# Altium project VESC6.PrjPcb
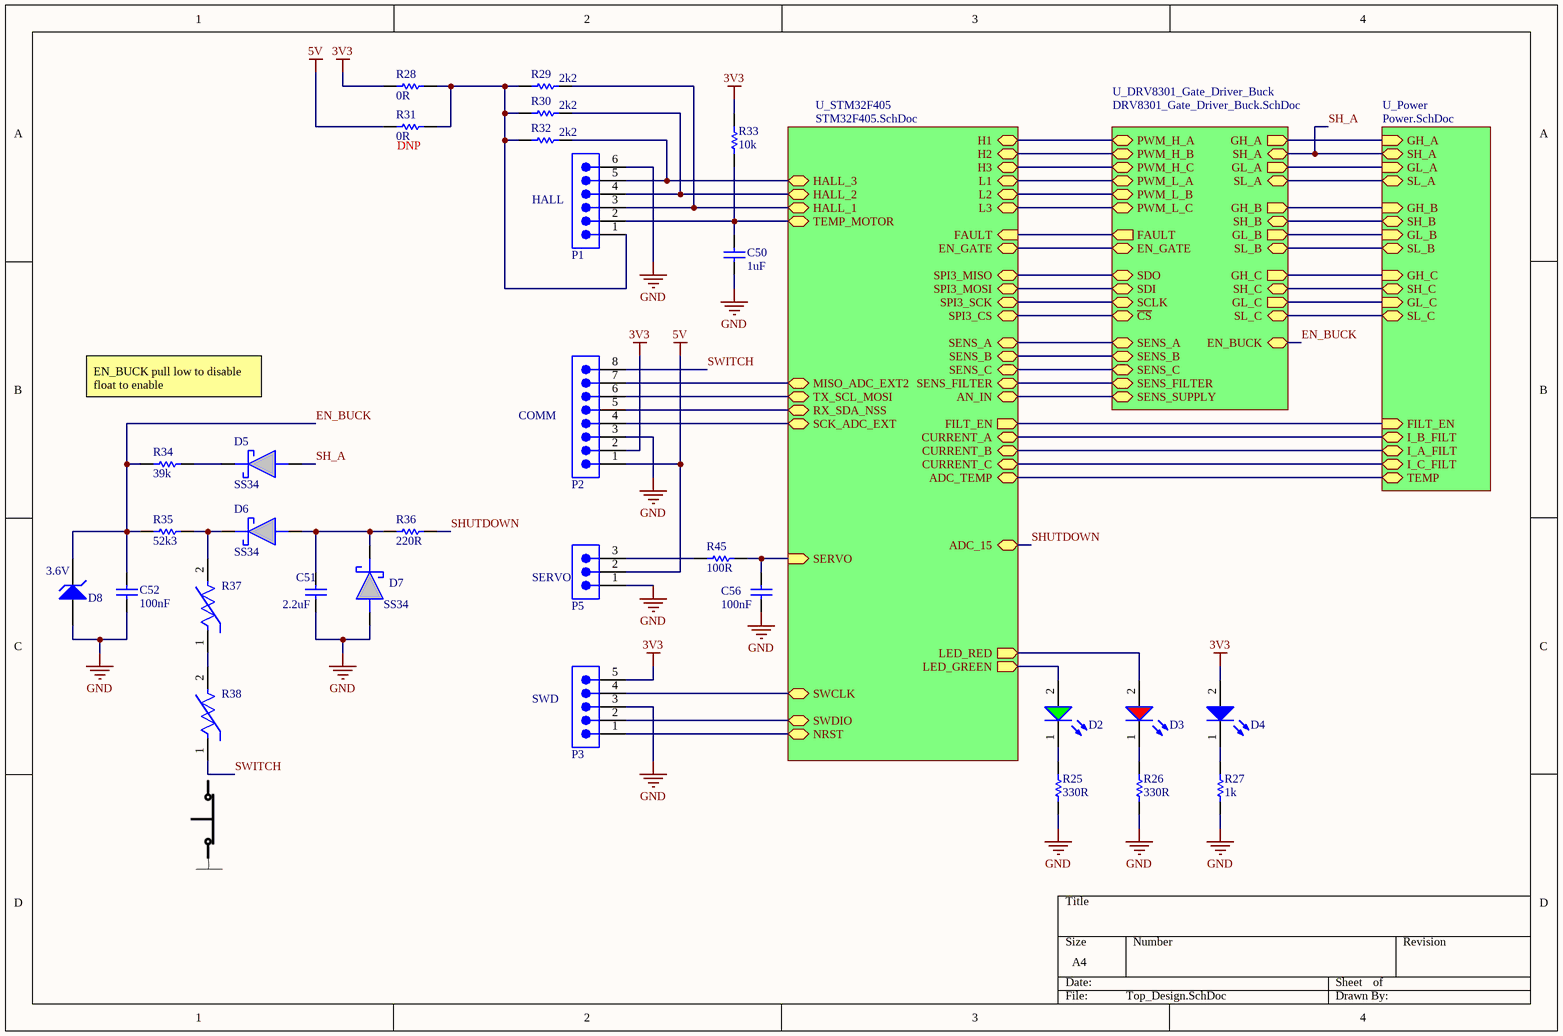
[diagram p0: Top_Design.SchDoc]
4 sheets, 139 parts. Net scope: hierarchical (ports join the sheet entries above them; power ports are global).
Board file: Main_PCB.PcbDoc
Sheets:
  Top_Design.SchDoc
    U_DRV8301_Gate_Driver_Buck = DRV8301_Gate_Driver_Buck.SchDoc
    U_Power = Power.SchDoc
    U_STM32F405 = STM32F405.SchDoc

## Sheet Top_Design.SchDoc
size A4; SheetNumber: 1; SheetTotal: 4

### Parts
C50  value 1uF  [Wurth 0603 capacitor]  (hidden comment: Generic Capacitor 1uF 0603)
C51  value 2.2uF  [Wurth 0603 capacitor]  (hidden comment: Generic Capacitor 2.2uF 0603)
C52  value 100nF  [Wurth 0603 capacitor]  (hidden comment: Generic Capacitor 100nF 0603)
C56  value 100nF  [Wurth 0603 capacitor]  (hidden comment: Generic Capacitor 100nF 0603)
D2  Green, 3.2V, 140°  [Wurth 0603 LED]  (value not drawn)
D3  Red, 2V, 140°  [Wurth 0603 LED]  (value not drawn)
D4  Blue, 3.2V, 140°  [Wurth 0603 LED]  (value not drawn)
D5  SS34  [MDD DO-214AC diode]
D6  SS34  [MDD DO-214AC diode]
D7  SS34  [MDD DO-214AC diode]
D8  ROHM EDZVT2R3.6B  [ROHM SOD-523 zener]  (value not drawn)
P1  61300611121  [6x1 2.54mm M]  (value not drawn)
P2  61300811121  [8x1 2.54mm M]  (value not drawn)
P3  61300511121  [5x1 2.54mm M]  (value not drawn)
P5  61300311121  [3x1 2.54mm M]  (value not drawn)
R25  value 330R  [Wurth 0603 Resistor]  (hidden comment: Generic Resistor 330R 0603)
R26  value 330R  [Wurth 0603 Resistor]  (hidden comment: Generic Resistor 330R 0603)
R27  value 1k  [Wurth 0603 Resistor]  (hidden comment: Generic Resistor 1k 0603)
R28  value 0R  [Wurth 0603 Resistor]  (hidden comment: Generic Resistor 0R 0603)
R29  value 2k2  [Wurth 0603 Resistor]  (hidden comment: Generic Resistor 2k2 0603)
R30  value 2k2  [Wurth 0603 Resistor]  (hidden comment: Generic Resistor 2k2 0603)
R31  value 0R  [Wurth 0603 Resistor]  (hidden comment: Generic Resistor 0R 0603)
R32  value 2k2  [Wurth 0603 Resistor]  (hidden comment: Generic Resistor 2k2 0603)
R33  value 10k  [Wurth 0603 Resistor]  (hidden comment: Generic Resistor 10k 0603)
R34  value 39k  [Wurth 0603 Resistor]  (hidden comment: Generic Resistor 39k 0603)
R35  value 52k3  [Wurth 0603 Resistor]  (hidden comment: Generic Resistor 52k3 0603)
R36  value 220R  [Wurth 0603 Resistor]  (hidden comment: Generic Resistor 220R 0603)
R37  PRF15BC102RB6RC  [FP-PRF15-0_05-IPC_B]  (value not drawn)
R38  PRF15BC102RB6RC  [FP-PRF15-0_05-IPC_B]  (value not drawn)
R45  value 100R  [Wurth 0603 Resistor]  (hidden comment: Generic Resistor 100R 0603)

### Sub-sheets
U_DRV8301_Gate_Driver_Buck = DRV8301_Gate_Driver_Buck.SchDoc: GH_A (out), GH_B (out), GH_C (out), GL_A (out), GL_B (out), GL_C (out), SCLK (bidir), SDI (bidir), SDO (bidir), ~{CS} (bidir), SH_A (bidir), SL_A (bidir), SL_B (bidir), SL_C (bidir), PWM_L_A (bidir), PWM_L_B (bidir), PWM_L_C (bidir), PWM_H_C (bidir), PWM_H_B (bidir), PWM_H_A (bidir), SH_C (bidir), SH_B (bidir), EN_BUCK (bidir), SENS_A (bidir), SENS_B (bidir), SENS_C (bidir), EN_GATE (bidir), SENS_FILTER (bidir), SENS_SUPPLY (bidir), FAULT (out)
U_Power = Power.SchDoc: GH_A (in), GL_A (in), GH_B (in), GL_B (in), GH_C (in), GL_C (in), SH_A (bidir), SL_A (bidir), SH_B (bidir), SL_B (bidir), SH_C (bidir), SL_C (bidir), I_A_FILT (bidir), I_B_FILT (bidir), I_C_FILT (bidir), FILT_EN (in), TEMP (bidir)
U_STM32F405 = STM32F405.SchDoc: EN_GATE (bidir), RX_SDA_NSS (bidir), L1 (bidir), L2 (bidir), L3 (bidir), SENS_A (bidir), SENS_B (bidir), SENS_C (bidir), ADC_TEMP (bidir), SCK_ADC_EXT (bidir), H1 (bidir), H2 (bidir), H3 (bidir), SWDIO (bidir), SWCLK (bidir), CURRENT_A (bidir), CURRENT_B (bidir), CURRENT_C (bidir), AN_IN (bidir), TEMP_MOTOR (bidir), ADC_15 (bidir), HALL_1 (bidir), HALL_2 (bidir), HALL_3 (bidir), SPI3_CS (bidir), SPI3_SCK (bidir), SENS_FILTER (bidir), SPI3_MOSI (bidir), SPI3_MISO (bidir), LED_GREEN (out), LED_RED (out), MISO_ADC_EXT2 (bidir), TX_SCL_MOSI (bidir), FILT_EN (out), NRST (bidir), FAULT (in), SERVO (in)

### Nets
3V3: D4.2(A) P2.2 P3.5 R28.2 R33.2
5V: P2.1 P5.2 R31.2
GND: C50.1 C51.1 C52.1 C56.1 D7.2(A) D8.2(A) P1.6 P2.3 P3.3 P5.1 R25.2 R26.2 R27.2 ; sheet U_DRV8301_Gate_Driver_Buck/SL_A, sheet U_DRV8301_Gate_Driver_Buck/SL_B, sheet U_DRV8301_Gate_Driver_Buck/SL_C, sheet U_Power/SL_A, sheet U_Power/SL_B, sheet U_Power/SL_C
EN_BUCK: C52.2 D8.1(K) R34.1 R35.1 ; sheet U_DRV8301_Gate_Driver_Buck/EN_BUCK
FILT_EN: sheet U_Power/FILT_EN, sheet U_STM32F405/FILT_EN
SENS_FILTER: sheet U_DRV8301_Gate_Driver_Buck/SENS_FILTER, sheet U_STM32F405/SENS_FILTER
SH_A: D5.2(A) ; sheet U_DRV8301_Gate_Driver_Buck/SH_A, sheet U_Power/SH_A
SH_B: sheet U_DRV8301_Gate_Driver_Buck/SH_B, sheet U_Power/SH_B
SH_C: sheet U_DRV8301_Gate_Driver_Buck/SH_C, sheet U_Power/SH_C
SHUTDOWN: R36.2 ; sheet U_STM32F405/ADC_15
SWITCH: P2.8 R38.1
NetC10_2: sheet U_Power/I_A_FILT, sheet U_STM32F405/CURRENT_B
NetC13_2: sheet U_Power/I_B_FILT, sheet U_STM32F405/CURRENT_A
NetC15_2: sheet U_Power/I_C_FILT, sheet U_STM32F405/CURRENT_C
NetC33_1: sheet U_DRV8301_Gate_Driver_Buck/SENS_A, sheet U_STM32F405/SENS_A
NetC37_1: sheet U_DRV8301_Gate_Driver_Buck/SENS_B, sheet U_STM32F405/SENS_B
NetC40_1: sheet U_DRV8301_Gate_Driver_Buck/SENS_C, sheet U_STM32F405/SENS_C
NetC49_2: P3.1 ; sheet U_STM32F405/NRST
NetC50_2: C50.2 P1.2 R33.1 ; sheet U_STM32F405/TEMP_MOTOR
NetC51_2: C51.2 D6.2(A) D7.1(K) R36.1
NetC55_2: sheet U_Power/TEMP, sheet U_STM32F405/ADC_TEMP
NetC56_2: C56.2 R45.2 ; sheet U_STM32F405/SERVO
NetD2_1: D2.1(K) R25.1
NetD2_2: D2.2(A) ; sheet U_STM32F405/LED_GREEN
NetD3_1: D3.1(K) R26.1
NetD3_2: D3.2(A) ; sheet U_STM32F405/LED_RED
NetD4_1: D4.1(K) R27.1
NetD5_1: D5.1(K) R34.2
NetD6_1: D6.1(K) R35.2 R37.2
NetIC1_6: sheet U_DRV8301_Gate_Driver_Buck/FAULT, sheet U_STM32F405/FAULT
NetIC1_8: sheet U_DRV8301_Gate_Driver_Buck/~{CS}, sheet U_STM32F405/SPI3_CS
NetIC1_9: sheet U_DRV8301_Gate_Driver_Buck/SDI, sheet U_STM32F405/SPI3_MOSI
NetIC1_10: sheet U_DRV8301_Gate_Driver_Buck/SDO, sheet U_STM32F405/SPI3_MISO
NetIC1_11: sheet U_DRV8301_Gate_Driver_Buck/SCLK, sheet U_STM32F405/SPI3_SCK
NetIC1_16: sheet U_DRV8301_Gate_Driver_Buck/EN_GATE, sheet U_STM32F405/EN_GATE
NetIC1_17: sheet U_DRV8301_Gate_Driver_Buck/PWM_H_A, sheet U_STM32F405/H1
NetIC1_18: sheet U_DRV8301_Gate_Driver_Buck/PWM_L_A, sheet U_STM32F405/L1
NetIC1_19: sheet U_DRV8301_Gate_Driver_Buck/PWM_H_B, sheet U_STM32F405/H2
NetIC1_20: sheet U_DRV8301_Gate_Driver_Buck/PWM_L_B, sheet U_STM32F405/L2
NetIC1_21: sheet U_DRV8301_Gate_Driver_Buck/PWM_H_C, sheet U_STM32F405/H3
NetIC1_22: sheet U_DRV8301_Gate_Driver_Buck/PWM_L_C, sheet U_STM32F405/L3
NetIC1_35: sheet U_DRV8301_Gate_Driver_Buck/GL_C, sheet U_Power/GL_C
NetIC1_37: sheet U_DRV8301_Gate_Driver_Buck/GH_C, sheet U_Power/GH_C
NetIC1_40: sheet U_DRV8301_Gate_Driver_Buck/GL_B, sheet U_Power/GL_B
NetIC1_42: sheet U_DRV8301_Gate_Driver_Buck/GH_B, sheet U_Power/GH_B
NetIC1_45: sheet U_DRV8301_Gate_Driver_Buck/GL_A, sheet U_Power/GL_A
NetIC1_47: sheet U_DRV8301_Gate_Driver_Buck/GH_A, sheet U_Power/GH_A
NetP1_1: P1.1 R28.1 R29.1 R30.1 R31.1 R32.1
NetP1_3: P1.3 R29.2 ; sheet U_STM32F405/HALL_1
NetP1_4: P1.4 R30.2 ; sheet U_STM32F405/HALL_2
NetP1_5: P1.5 R32.2 ; sheet U_STM32F405/HALL_3
NetP2_4: P2.4 ; sheet U_STM32F405/SCK_ADC_EXT
NetP2_5: P2.5 ; sheet U_STM32F405/RX_SDA_NSS
NetP2_6: P2.6 ; sheet U_STM32F405/TX_SCL_MOSI
NetP2_7: P2.7 ; sheet U_STM32F405/MISO_ADC_EXT2
NetP3_2: P3.2 ; sheet U_STM32F405/SWDIO
NetP3_4: P3.4 ; sheet U_STM32F405/SWCLK
NetP5_3: P5.3 R45.1
NetQ7_2: sheet U_DRV8301_Gate_Driver_Buck/SENS_SUPPLY, sheet U_STM32F405/AN_IN
NetR37_1: R37.1 R38.2

### Notes on the sheet
- (near R31) DNP
- HALL
- EN_BUCK pull low to disable
  float to enable
- COMM
- (near D8) 3.6V
- (near P5) SERVO
- (near P3) SWD

### Library data of the parts
D2 = LED GREEN 0603: WL-SMCD Mono-color Chip LED Diffused, SMT, size 0603, Green, 3.2V, 140°; Manufacturer Part Number: 150060GS55040; Manufacturer: Wurth Elektronik; Case/Size Code: 0603; Chip Technology: InGaN; Dominant Wavelength: 525nm; Luminous Intensity: 430mcd; Peak Wavelength: 520nm; Category: Signal LEDs; Match Code: WL-SMCD; ComponentLink1Description: Website Link; ComponentLink1URL: https://www.we-online.com/redexpert/article/150060GS55040?ad; ComponentLink2Description: Datasheet Link; ComponentLink2URL: https://www.we-online.com/redexpert/spec/150060GS55040?ad; Mount: Surface Mount; Operating Temperature Max: 85°C; Operating Temperature Min: -40°C; Packaging: Tape and Reel; Length: 1.6mm; Width: 0.8mm; Height: 0.4mm; Emitting Color: Green; Forward Voltage: 3.2V; Viewing Angle: 140°
D3 = LED RED 0603: WL-SMCD Mono-color Chip LED Diffused, SMT, size 0603, Red, 2V, 140°; Manufacturer Part Number: 150060RS55040; Manufacturer: Wurth Elektronik; Case/Size Code: 0603; Chip Technology: AlInGaP; Dominant Wavelength: 624nm; Luminous Intensity: 90mcd; Peak Wavelength: 632nm; Category: Signal LEDs; Match Code: WL-SMCD; ComponentLink1Description: Website Link; ComponentLink1URL: https://www.we-online.com/redexpert/article/150060RS55040?ad; ComponentLink2Description: Datasheet Link; ComponentLink2URL: https://www.we-online.com/redexpert/spec/150060RS55040?ad; Mount: Surface Mount; Operating Temperature Max: 85°C; Operating Temperature Min: -40°C; Packaging: Tape and Reel; Length: 1.6mm; Width: 0.8mm; Height: 0.4mm; Emitting Color: Red; Forward Voltage: 2V; Viewing Angle: 140°
D4 = LED BLUE 0603: WL-SMCD Mono-color Chip LED Diffused, SMT, size 0603, Blue, 3.2V, 140°; Manufacturer Part Number: 150060BS55040; Manufacturer: Wurth Elektronik; Case/Size Code: 0603; Chip Technology: InGaN; Dominant Wavelength: 470nm; Luminous Intensity: 80mcd; Peak Wavelength: 465nm; Category: Signal LEDs; Match Code: WL-SMCD; ComponentLink1Description: Website Link; ComponentLink1URL: https://www.we-online.com/redexpert/article/150060BS55040?ad; ComponentLink2Description: Datasheet Link; ComponentLink2URL: https://www.we-online.com/redexpert/spec/150060BS55040?ad; Mount: Surface Mount; Operating Temperature Max: 85°C; Operating Temperature Min: -40°C; Packaging: Tape and Reel; Length: 1.6mm; Width: 0.8mm; Height: 0.4mm; Emitting Color: Blue; Forward Voltage: 3.2V; Viewing Angle: 140°
D5-D7 = MDD SS34: SS34 Schottky Barrier Diodes (SBD) SMA(DO-214AC) RoHS; Manufacturer_Name: MDD; Geometry.Height: 2.44mm; Manufacturer_Part_Number: SS34; Mouser Part Number: *; Mouser Price/Stock: *; Arrow Part Number: *; Arrow Price/Stock: *; Datasheet Link: https://datasheet.lcsc.com/szlcsc/MDD-Jiangsu-Yutai-Elec-SS34_C13762.pdf
D8 = 3.6V 150mW zener: Independent 3.6V~3.845V 150mW 3.6V SOD-523 Zener Diodes ROHS
P1 = 6P: WR-PHD Pin Header, THT, Vertical, pitch 2.54mm, 1 Row, 6P; Manufacturer: Wurth Elektronik; Contact Resistance: 20mOhm; Rated Current: 3A; Working Voltage: 250V; Withstanding Voltage: 500V; Manufacturer Part Number: 61300611121; Category: Board-to-Board Connectors; Match Code: WR-PHD; ComponentLink1Description: Website Link; ComponentLink1URL: https://www.we-online.com/redexpert/article/61300611121?ad; ComponentLink2Description: Datasheet Link; ComponentLink2URL: https://www.we-online.com/redexpert/spec/61300611121?ad; Mount: Through Hole; Operating Temperature Max: 105°C; Operating Temperature Min: -40°C; Packaging: Bag; Gender: Pin Header; Number of Pins: 6; Number of Rows: 1; Orientation: Vertical; Pitch: 2.54mm
P2 = 8P: WR-PHD Pin Header, THT, Vertical, pitch 2.54mm, 1 Row, 8P; Manufacturer: Wurth Elektronik; Contact Resistance: 20mOhm; Rated Current: 3A; Working Voltage: 250V; Withstanding Voltage: 500V; Manufacturer Part Number: 61300811121; Category: Board-to-Board Connectors; Match Code: WR-PHD; ComponentLink1Description: Website Link; ComponentLink1URL: https://www.we-online.com/redexpert/article/61300811121?ad; ComponentLink2Description: Datasheet Link; ComponentLink2URL: https://www.we-online.com/redexpert/spec/61300811121?ad; Mount: Through Hole; Operating Temperature Max: 105°C; Operating Temperature Min: -40°C; Packaging: Bag; Gender: Pin Header; Number of Pins: 8; Number of Rows: 1; Orientation: Vertical; Pitch: 2.54mm
P3 = 5P: WR-PHD Pin Header, THT, Vertical, pitch 2.54mm, 1 Row, 5P; Manufacturer: Wurth Elektronik; Contact Resistance: 20mOhm; Rated Current: 3A; Working Voltage: 250V; Withstanding Voltage: 500V; Manufacturer Part Number: 61300511121; Category: Board-to-Board Connectors; Match Code: WR-PHD; ComponentLink1Description: Website Link; ComponentLink1URL: https://www.we-online.com/redexpert/article/61300511121?ad; ComponentLink2Description: Datasheet Link; ComponentLink2URL: https://www.we-online.com/redexpert/spec/61300511121?ad; Mount: Through Hole; Operating Temperature Max: 105°C; Operating Temperature Min: -40°C; Packaging: Bag; Gender: Pin Header; Number of Pins: 5; Number of Rows: 1; Orientation: Vertical; Pitch: 2.54mm
P5 = 3P: WR-PHD Pin Header, THT, Vertical, pitch 2.54mm, 1 Row, 3P; Manufacturer: Wurth Elektronik; Contact Resistance: 20mOhm; Rated Current: 3A; Working Voltage: 250V; Withstanding Voltage: 500V; Manufacturer Part Number: 61300311121; Category: Board-to-Board Connectors; Match Code: WR-PHD; ComponentLink1Description: Website Link; ComponentLink1URL: https://www.we-online.com/redexpert/article/61300311121?ad; ComponentLink2Description: Datasheet Link; ComponentLink2URL: https://www.we-online.com/redexpert/spec/61300311121?ad; Mount: Through Hole; Operating Temperature Max: 105°C; Operating Temperature Min: -40°C; Packaging: Bag; Gender: Pin Header; Number of Pins: 3; Number of Rows: 1; Orientation: Vertical; Pitch: 2.54mm
R37 R38 = CMP-06022-000468-1: THERMISTOR PTC 1K OHM 50% 0402; Voltage: 32V; Resistance: 1kR; Case Code (Metric): 1005; Packaging: Tape and Reel; Depth: 0.5mm; Case Code (Imperial): 0402; Length: 1mm; Case/Package: 0402; Number of Pins: 2; Tolerance: 50%; Height: 0.5mm; Min Operating Temperature: -40°C; Mount: Surface Mount; Max Operating Temperature: 130°C; Width: 0.5mm; Termination: SMD/SMT; Package Quantity: 10000

## Sheet DRV8301_Gate_Driver_Buck.SchDoc
size A4; SheetNumber: 3; SheetTotal: 4
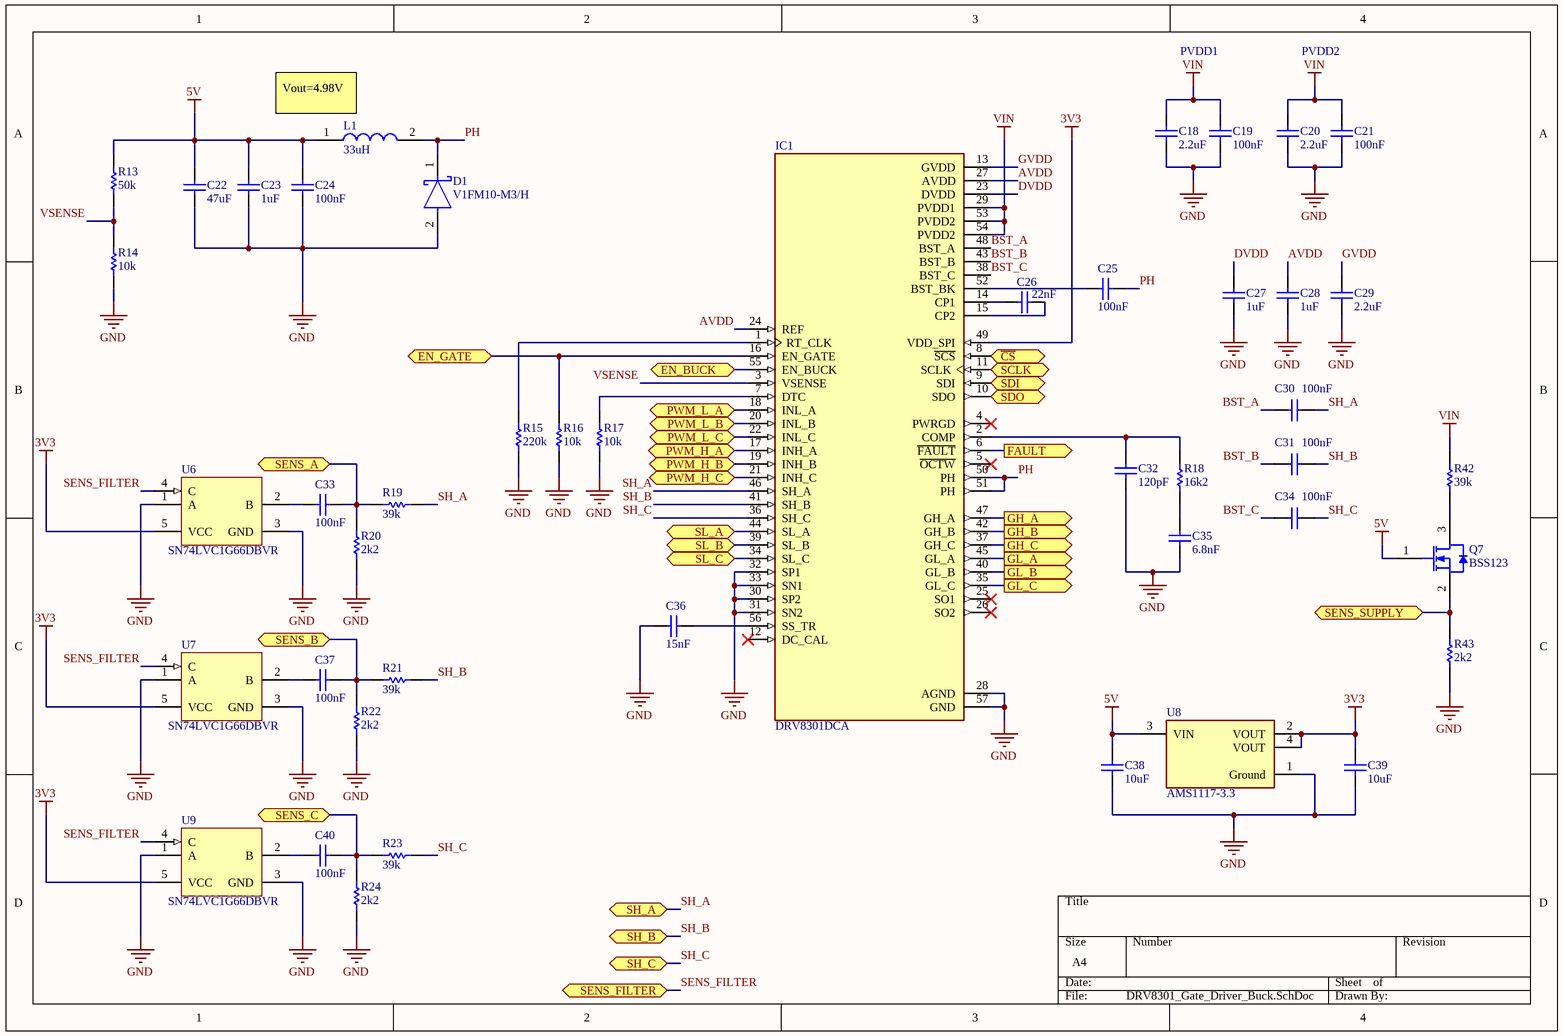
[diagram p1: DRV8301_Gate_Driver_Buck.SchDoc]

### Parts
C18  value 2.2uF  [Wurth 0603 capacitor]  (hidden comment: Generic Capacitor 2.2uF 0603)
C19  value 100nF  [Wurth 0603 capacitor]  (hidden comment: Generic Capacitor 100nF 0603)
C20  value 2.2uF  [Wurth 0603 capacitor]  (hidden comment: Generic Capacitor 2.2uF 0603)
C21  value 100nF  [Wurth 0603 capacitor]  (hidden comment: Generic Capacitor 100nF 0603)
C22  value 47uF  [Wurth 1206 Capacitor]  (hidden comment: Generic Capacitor 47uF 1206)
C23  value 1uF  [Wurth 0603 capacitor]  (hidden comment: Generic Capacitor 1uF 0603)
C24  value 100nF  [Wurth 0603 capacitor]  (hidden comment: Generic Capacitor 100nF 0603)
C25  value 100nF  [Wurth 0603 capacitor]  (hidden comment: Generic Capacitor 100nF 0603)
C26  value 22nF  [Wurth 0603 capacitor]  (hidden comment: Generic Capacitor 22nF 0603)
C27  value 1uF  [Wurth 0603 capacitor]  (hidden comment: Generic Capacitor 1uF 0603)
C28  value 1uF  [Wurth 0603 capacitor]  (hidden comment: Generic Capacitor 1uF 0603)
C29  value 2.2uF  [Wurth 0603 capacitor]  (hidden comment: Generic Capacitor 2.2uF 0603)
C30  value 100nF  [Wurth 0603 capacitor]  (hidden comment: Generic Capacitor 100nF 0603)
C31  value 100nF  [Wurth 0603 capacitor]  (hidden comment: Generic Capacitor 100nF 0603)
C32  value 120pF  [Wurth 0603 capacitor]  (hidden comment: Generic Capacitor 120pF 0603)
C33  value 100nF  [Wurth 0603 capacitor]  (hidden comment: Generic Capacitor 100nF 0603)
C34  value 100nF  [Wurth 0603 capacitor]  (hidden comment: Generic Capacitor 100nF 0603)
C35  value 6.8nF  [Wurth 0603 capacitor]  (hidden comment: Generic Capacitor 6.8nF 0603)
C36  value 15nF  [Wurth 0603 capacitor]  (hidden comment: Generic Capacitor 15nF 0603)
C37  value 100nF  [Wurth 0603 capacitor]  (hidden comment: Generic Capacitor 100nF 0603)
C38  value 10uF  [Wurth 0805 capacitor]  (hidden comment: Generic Capacitor 10uF 0805)
C39  value 10uF  [Wurth 0805 capacitor]  (hidden comment: Generic Capacitor 10uF 0805)
C40  value 100nF  [Wurth 0603 capacitor]  (hidden comment: Generic Capacitor 100nF 0603)
D1  V1FM10-M3/H  [FP-V1FM10-M3-H-MFG]
IC1  DRV8301DCA  [TI HTSSOP-56-6mm]
L1  value 33uH  [FH MS127-330MT]  (hidden comment: FH 33uH 3A)
Q7  BSS123  [FAIR-SOT23-3_V]
R13  value 50k  [Wurth 0603 Resistor]  (hidden comment: Generic Resistor 50k 0603)
R14  value 10k  [Wurth 0603 Resistor]  (hidden comment: Generic Resistor 10k 0603)
R15  value 220k  [Wurth 0603 Resistor]  (hidden comment: Generic Resistor 220k 0603)
R16  value 10k  [Wurth 0603 Resistor]  (hidden comment: Generic Resistor 10k 0603)
R17  value 10k  [Wurth 0603 Resistor]  (hidden comment: Generic Resistor 10k 0603)
R18  value 16k2  [Wurth 0603 Resistor]  (hidden comment: Generic Resistor 16k2 0603)
R19  value 39k  [Wurth 0603 Resistor]  (hidden comment: Generic Resistor 39k 0603)
R20  value 2k2  [Wurth 0603 Resistor]  (hidden comment: Generic Resistor 2k2 0603)
R21  value 39k  [Wurth 0603 Resistor]  (hidden comment: Generic Resistor 39k 0603)
R22  value 2k2  [Wurth 0603 Resistor]  (hidden comment: Generic Resistor 2k2 0603)
R23  value 39k  [Wurth 0603 Resistor]  (hidden comment: Generic Resistor 39k 0603)
R24  value 2k2  [Wurth 0603 Resistor]  (hidden comment: Generic Resistor 2k2 0603)
R42  value 39k  [Wurth 0603 Resistor]  (hidden comment: Generic Resistor 39k 0603)
R43  value 2k2  [Wurth 0603 Resistor]  (hidden comment: Generic Resistor 2k2 0603)
U6  SN74LVC1G66DBVR  [DBV0005A_L]
U7  SN74LVC1G66DBVR  [DBV0005A_L]
U8  AMS1117-3.3  [FP-AMS1117-IPC_C]
U9  SN74LVC1G66DBVR  [DBV0005A_L]

### Ports
EN_BUCK (bidir), EN_GATE (bidir), FAULT (out), GH_A (out), GH_B (out), GH_C (out), GL_A (out), GL_B (out), GL_C (out), PWM_H_A (bidir), PWM_H_B (bidir), PWM_H_C (bidir), PWM_L_A (bidir), PWM_L_B (bidir), PWM_L_C (bidir), SCLK (bidir), SDI (bidir), SDO (bidir), SENS_A (bidir), SENS_B (bidir), SENS_C (bidir), SENS_FILTER (bidir), SENS_SUPPLY (bidir), SH_A (bidir), SH_B (bidir), SH_C (bidir), SL_A (bidir), SL_B (bidir), SL_C (bidir), ~{CS} (bidir)

### Nets
3V3: C39.2 IC1.49(VDD_SPI) U6.5(VCC) U7.5(VCC) U8.2(VOUT) U8.4(VOUT) U9.5(VCC)
5V: C22.2 C23.2 C24.1 C38.2 L1.1 Q7.1(G) R13.2 U8.3(VIN)
GND: C18.1 C19.1 C20.1 C21.1 C22.1 C23.1 C24.2 C27.1 C28.1 C29.1 C32.1 C35.1 C36.1 C38.1 C39.1 D1.2(A) IC1.28(AGND) IC1.30(SP2) IC1.31(SN2) IC1.32(SP1) IC1.33(SN1) IC1.34(SL_C) IC1.39(SL_B) IC1.44(SL_A) IC1.57(GND) R14.1 R15.1 R16.1 R17.1 R20.1 R22.1 R24.1 R43.1 U6.1(A) U6.3(GND) U7.1(A) U7.3(GND) U8.1(Ground) U9.1(A) U9.3(GND) ; port SL_A, port SL_B, port SL_C
VIN: C18.2 C19.2 C20.2 C21.2 IC1.29(PVDD1) IC1.53(PVDD2) IC1.54(PVDD2) R42.2
AVDD: C28.2 IC1.24(REF) IC1.27(AVDD)
BST_A: C30.2 IC1.48(BST_A)
BST_B: C31.2 IC1.43(BST_B)
BST_C: C34.2 IC1.38(BST_C)
DVDD: C27.2 IC1.23(DVDD)
EN_BUCK: IC1.55(EN_BUCK) ; port EN_BUCK
GVDD: C29.2 IC1.13(GVDD)
PH: C25.1 D1.1(C) IC1.50(PH) IC1.51(PH) L1.2
SENS_FILTER: U6.4(C) U7.4(C) U9.4(C) ; port SENS_FILTER
SH_A: C30.1 IC1.46(SH_A) R19.2 ; port SH_A
SH_B: C31.1 IC1.41(SH_B) R21.2 ; port SH_B
SH_C: C34.1 IC1.36(SH_C) R23.2 ; port SH_C
VSENSE: IC1.3(VSENSE) R13.1 R14.2
NetC25_2: C25.2 IC1.52(BST_BK)
NetC26_1: C26.1 IC1.14(CP1)
NetC26_2: C26.2 IC1.15(CP2)
NetC32_2: C32.2 IC1.2(COMP) R18.2
NetC33_1: C33.1 R19.1 R20.2 ; port SENS_A
NetC33_2: C33.2 U6.2(B)
NetC35_2: C35.2 R18.1
NetC36_2: C36.2 IC1.56(SS_TR)
NetC37_1: C37.1 R21.1 R22.2 ; port SENS_B
NetC37_2: C37.2 U7.2(B)
NetC40_1: C40.1 R23.1 R24.2 ; port SENS_C
NetC40_2: C40.2 U9.2(B)
NetIC1_1: IC1.1(RT_CLK) R15.2
NetIC1_6: IC1.6(~{FAULT}) ; port FAULT
NetIC1_7: IC1.7(DTC) R17.2
NetIC1_8: IC1.8(~{SCS}) ; port ~{CS}
NetIC1_9: IC1.9(SDI) ; port SDI
NetIC1_10: IC1.10(SDO) ; port SDO
NetIC1_11: IC1.11(SCLK) ; port SCLK
NetIC1_16: IC1.16(EN_GATE) R16.2 ; port EN_GATE
NetIC1_17: IC1.17(INH_A) ; port PWM_H_A
NetIC1_18: IC1.18(INL_A) ; port PWM_L_A
NetIC1_19: IC1.19(INH_B) ; port PWM_H_B
NetIC1_20: IC1.20(INL_B) ; port PWM_L_B
NetIC1_21: IC1.21(INH_C) ; port PWM_H_C
NetIC1_22: IC1.22(INL_C) ; port PWM_L_C
NetIC1_35: IC1.35(GL_C) ; port GL_C
NetIC1_37: IC1.37(GH_C) ; port GH_C
NetIC1_40: IC1.40(GL_B) ; port GL_B
NetIC1_42: IC1.42(GH_B) ; port GH_B
NetIC1_45: IC1.45(GL_A) ; port GL_A
NetIC1_47: IC1.47(GH_A) ; port GH_A
NetQ7_2: Q7.2(S) R43.2 ; port SENS_SUPPLY
NetQ7_3: Q7.3(D) R42.1

Not connected (* = marked no-connect by the designer): IC1 4(PWRGD)* 5(~{OCTW})* 12(DC_CAL)* 25(SO1)* 26(SO2)*

### Notes on the sheet
- (near L1) Vout=4.98V
- PVDD1
- PVDD2

### Library data of the parts
D1 = CMP-02539-000045-1: 1A 100V SMF TRENCH SKY RECT; RoHS Compliant: Yes
IC1 = DRV8301DCA: Power MOSFET Tube DRV8301 General Purpose motor driver 60V 1.7A 6.1mm -40C~125C TA; Manufacturer: Texas Instruments; Manufacturer Lifecycle Status: ACTIVE; Min Supply Voltage: 8V; Motor Type: Brushless DC (BLDC); Nominal Supply Current: 15mA; Number of Outputs: 1; Switching Frequency: 581kHz; Supplier: DigiKey; Supplier Part Number: 296-33274-5-ND; Manufacturer Part Number: DRV8301DCA; RoHS: Compliant; Category: Motor Drivers; Stock: 484; Pricing: 1=8,65, 10=6,719, 35=6,08629, 105=5,6881, 280=5,42282, 525=5,28747, 1015=5,16895 (USD); Case/Package: HTSSOP EP; Collector Emitter Voltage (VCEO): 60V; Height: 0m; Lead Free: Lead Free; Length: 14mm; Lifecycle Status: Production; Max Collector Current: 1.7A; Max Operating Temperature: 125°C; Max Supply Voltage: 60V; Min Operating Temperature: -40°C; Mounting Technology: Surface Mount; Pins: 56; Output Current: 1.7A; Radiation Hardening: No; REACH SVHC: No; Schedule B: 8542390000, 8542390000|8542390000|8542390000|8542390000|8542390000; Thickness: 1.15mm; Width: 6.1mm; ComponentLink1URL: https://sigma.octopart.com:443/184264061/technical_drawing/Texas-Instruments-DRV8301DCA.pdf?src-supplier=Texas+Instruments; ComponentLink1Description: https://sigma.octopart.com:443/184264061/technical_drawing/Texas-Instruments-DRV8301DCA.pdf?src-supplier=Texas+Instruments; ComponentLink2URL: https://octopart.com:443/opatz8j6/c1?t=8IUW2FYany34oJhLIyHX3Y1fI0NJBmozTUbG1CqNyPuNWTClGH-cr3TDyKeqxYPvaWCzT3FtFYre7m4Q0_NcEhaCaz4mrMBkw0JmabNj41SeHht1JXpUurlK2fwJkF59zymHjMraghvG0clGbmEpzk0-1Fi2LYVcqmMUSmJHOw8q5i15A0eOjXHAa3tkv_LsOMxXLpDcJMa_aqbVn0SPweYESkxUytDlv3TAlM6oY4J7IJJC2EjEwwEhPkQH_CuYhf8Ti-24CIEoT0h5OGCtdkTCzKVjqTotWSRYtTVQ0Tt15DGuyh5ljNo7b3BiePRRkOR3ODNP-x8tZIUca-sycMCq3AzyRFgJ2UNMLmvyduJzVS1Z3H-8J0ToKnTQpxkchCca5Q&src-supplier=Texas+Instruments; ComponentLink2Description: https://octopart.com:443/opatz8j6/c1?t=8IUW2FYany34oJhLIyHX3Y1fI0NJBmozTUbG1CqNyPuNWTClGH-cr3TDyKeqxYPvaWCzT3FtFYre7m4Q0_NcEhaCaz4mrMBkw0JmabNj41SeHht1JXpUurlK2fwJkF59zymHjMraghvG0clGbmEpzk0-1Fi2LYVcqmMUSmJHOw8q5i15A0eOjXHAa3tkv_LsOMxXLpDcJMa_aqbVn0SPweYESkxUytDlv3TAlM6oY4J7IJJC2EjEwwEhPkQH_CuYhf8Ti-24CIEoT0h5OGCtdkTCzKVjqTotWSRYtTVQ0Tt15DGuyh5ljNo7b3BiePRRkOR3ODNP-x8tZIUca-sycMCq3AzyRFgJ2UNMLmvyduJzVS1Z3H-8J0ToKnTQpxkchCca5Q&src-supplier=Texas+Instruments; ComponentLink3URL: https://datasheet.octopart.com:443/DRV8301DCA-Texas-Instruments-datasheet-17277489.pdf?src-supplier=Texas+Instruments; ComponentLink3Description: https://datasheet.octopart.com:443/DRV8301DCA-Texas-Instruments-datasheet-17277489.pdf?src-supplier=Texas+Instruments; ComponentLink4URL: https://datasheet.octopart.com:443/DRV8301DCA-Texas-Instruments-datasheet-15540827.pdf?src-supplier=Texas+Instruments; ComponentLink4Description: https://datasheet.octopart.com:443/DRV8301DCA-Texas-Instruments-datasheet-15540827.pdf?src-supplier=Texas+Instruments; ComponentLink5URL: https://datasheet.octopart.com:443/DRV8301DCA-Texas-Instruments-datasheet-11520822.pdf?src-supplier=Texas+Instruments; ComponentLink5Description: https://datasheet.octopart.com:443/DRV8301DCA-Texas-Instruments-datasheet-11520822.pdf?src-supplier=Texas+Instruments; ComponentLink6URL: https://sigma.octopart.com:443/49252451/technical_drawing/Texas-Instruments-DRV8301DCA.pdf?src-supplier=Texas+Instruments; ComponentLink6Description: https://sigma.octopart.com:443/49252451/technical_drawing/Texas-Instruments-DRV8301DCA.pdf?src-supplier=Texas+Instruments; ComponentLink7URL: https://datasheet.octopart.com:443/DRV8301DCA-Texas-Instruments-datasheet-37101717.pdf?src-supplier=Newark; ComponentLink7Description: https://datasheet.octopart.com:443/DRV8301DCA-Texas-Instruments-datasheet-37101717.pdf?src-supplier=Newark; ComponentLink8URL: https://datasheet.octopart.com:443/DRV8301DCA-Texas-Instruments-datasheet-33018439.pdf?src-supplier=Newark; ComponentLink8Description: https://datasheet.octopart.com:443/DRV8301DCA-Texas-Instruments-datasheet-33018439.pdf?src-supplier=Newark; ComponentLink9URL: https://datasheet.octopart.com:443/DRV8301DCA-Texas-Instruments-datasheet-10540733.pdf?src-supplier=Upverter; ComponentLink9Description: https://datasheet.octopart.com:443/DRV8301DCA-Texas-Instruments-datasheet-10540733.pdf?src-supplier=Upverter; ComponentLink10URL: https://datasheet.octopart.com:443/DRV8301DCA-Texas-Instruments-datasheet-102488708.pdf?src-supplier=Farnell; ComponentLink10Description: https://datasheet.octopart.com:443/DRV8301DCA-Texas-Instruments-datasheet-102488708.pdf?src-supplier=Farnell; ComponentLink11URL: https://datasheet.octopart.com:443/DRV8301DCA-Texas-Instruments-datasheet-163231296.pdf?src-supplier=SHENGYU+ELECTRONICS; ComponentLink11Description: https://datasheet.octopart.com:443/DRV8301DCA-Texas-Instruments-datasheet-163231296.pdf?src-supplier=SHENGYU+ELECTRONICS; ComponentLink12URL: https://datasheet.octopart.com:443/DRV8301DCA-Texas-Instruments-datasheet-154627238.pdf?src-supplier=IBE+SMT+Equipment; ComponentLink12Description: https://datasheet.octopart.com:443/DRV8301DCA-Texas-Instruments-datasheet-154627238.pdf?src-supplier=IBE+SMT+Equipment; ComponentLink13URL: http://sigma.octopart.com:80/conflict_mineral_statement/Texas-Instruments-company-63.pdf?src-supplier=Compliance+Statements; ComponentLink13Description: http://sigma.octopart.com:80/conflict_mineral_statement/Texas-Instruments-company-63.pdf?src-supplier=Compliance+Statements; ComponentLink14URL: http://sigma.octopart.com:80/reach_statement/Texas-Instruments-company-64.pdf?src-supplier=Compliance+Statements; ComponentLink14Description: http://sigma.octopart.com:80/reach_statement/Texas-Instruments-company-64.pdf?src-supplier=Compliance+Statements
Q7 = CMP-2000-04934-1: N-Channel Logic Level Enhancement Mode Field Effect Transistor, 1.7 V, -55 to 150 degC, 3-Pin SOT-23, RoHS, Tape and Reel; Manufacturer: Fairchild; Channel Type: N; Typical Turn-Off Delay Time: 17ns; Maximum Continuous Drain Current: 0.17A; Rad Hard: No; Typical Rise Time: 9ns; Typical Fall Time: 2.4ns; Maximum Gate Source Voltage: ±20V; Maximum Drain Source Voltage: 100V; Typical Turn-On Delay Time: 1.7ns; RDS-on: 6000@10VmOhm; Package Version: Rev. 12, 03/2016; Packaging: Tape&Reel; Package Reference: SOT23-3; Channel Mode: Enhancement; Operating Temperature: -55to150degC; Package Description: 3-Pin Small Outline Transistor, Body 2.92 x 1.325 mm, Pitch 0.95 mm; Category: MOSFET; Datasheet Version: Jun-03; Datasheet URL: https://www.fairchildsemi.com/datasheets/BS/BSS123.pdf; Manufacturer URL: https://www.fairchildsemi.com/; Mounting: SurfaceMount; Package: 3SOT-23; Package URL: http://www.fairchildsemi.com/dwg/MA/MA03D.pdf
U6 U7 U9 = CMP-0859-00173-3: Single Analog Switch, DBV0005A, LARGE T&R; Manufacturer: Texas Instruments; Output Drive (IOL/IOH)(Max)(mA): 32/-32; ICC @ Nom Voltage(Max)(mA): 0.01; VCC(Min)(V): 1.65; Rating: Catalog; Bits(#): 1; tpd @ Nom Voltage(Max)(ns): 2,1.2,0.8,0.6; Logic: True; Output Type: CMOS; Schmitt Trigger: No; Switch Configuration: SPST; Input Type: CMOS/TTL; F @ Nom Voltage(Max)(Mhz): 150; VCC(Max)(V): 5.5; Technology Family: LVC; Voltage(Nom)(V): 1.8,2.5,3.3,5; Operating Temperature Range(C): -40 to 85; Generic Part Number: SN74LVC1G66; DatasheetVersion: SCES323O; PackageReference: DBV0005A; Channels(#): 1; 3-State Output: No
U8 = CMP-209535-000001-1: LDO Voltage Regulators 1A, 3.3V; Manufacturer: Advanced Monolithic Systems; Dropout Voltage: 1.1V; Output Type: Fixed; Nominal Supply Current: 5mA; Max Power Dissipation: 1.2W; Max Supply Voltage: 15V; Number Of Outputs: 1; Standoff Height: 0.64mm; Max Junction Temp: +125°C; Height: 1.8mm; Package: AMS1117; Device Class L2: Power Management ICs; ComponentLink2Description: Datasheet; ComponentLink2URL: http://www.advanced-monolithic.com/pdf/ds1117.pdf; Category: IC; RoHS: TRUE; Automotive: No; Device Class L1: Integrated Circuits (ICs); Output Current: 1A; Device Class L3: Voltage Regulators - Linear; Temperature: -40°C to +125°C; Output Voltage: 3.3V; Manufacturer Part Number: AMS1117-3.3; Temperature Range Low: -40°C; Octopart: https://octopart.com/ams1117-3.3-advanced+monolithic+systems-25899300; Lead Free: Yes; Ipc Land Pattern Name: SOT229P700X180-4; Temperature Range High: +125°C

## Sheet Power.SchDoc
size A4; SheetNumber: 4; SheetTotal: 4
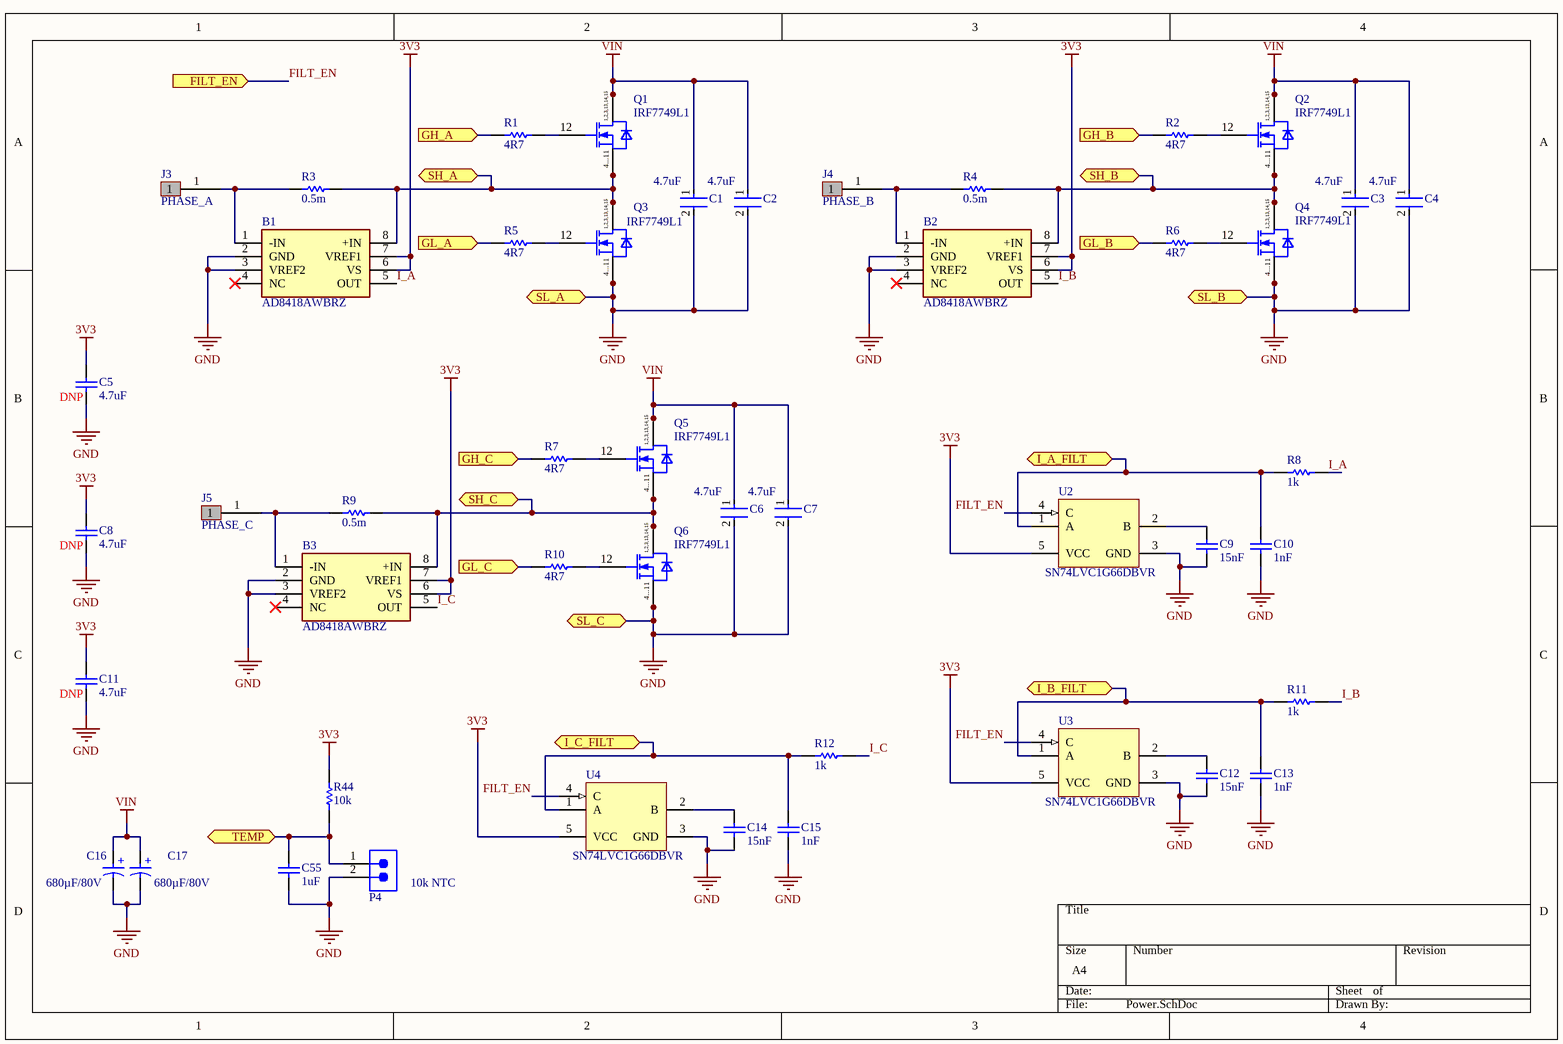
[diagram p2: Power.SchDoc]

### Parts
B1  AD8418AWBRZ  [SOP65P490X110-8N]
B2  AD8418AWBRZ  [SOP65P490X110-8N]
B3  AD8418AWBRZ  [SOP65P490X110-8N]
C1  Capacitance: 4.7uF  [FP-1210-L_3_2_0_3-W_2_5_0-IPC_A]  (hidden comment: HMK325C7475KN-TE)
C2  Capacitance: 4.7uF  [FP-1210-L_3_2_0_3-W_2_5_0-IPC_A]  (hidden comment: HMK325C7475KN-TE)
C3  Capacitance: 4.7uF  [FP-1210-L_3_2_0_3-W_2_5_0-IPC_A]  (hidden comment: HMK325C7475KN-TE)
C4  Capacitance: 4.7uF  [FP-1210-L_3_2_0_3-W_2_5_0-IPC_A]  (hidden comment: HMK325C7475KN-TE)
C5  value 4.7uF  [Wurth 0603 capacitor]  (hidden comment: Generic Capacitor 4.7uF 0603)
C6  Capacitance: 4.7uF  [FP-1210-L_3_2_0_3-W_2_5_0-IPC_A]  (hidden comment: HMK325C7475KN-TE)
C7  Capacitance: 4.7uF  [FP-1210-L_3_2_0_3-W_2_5_0-IPC_A]  (hidden comment: HMK325C7475KN-TE)
C8  value 4.7uF  [Wurth 0603 capacitor]  (hidden comment: Generic Capacitor 4.7uF 0603)
C9  value 15nF  [Wurth 0603 capacitor]  (hidden comment: Generic Capacitor 15nF 0603)
C10  value 1nF  [Wurth 0603 capacitor]  (hidden comment: Generic Capacitor 1nF 0603)
C11  value 4.7uF  [Wurth 0603 capacitor]  (hidden comment: Generic Capacitor 4.7uF 0603)
C12  value 15nF  [Wurth 0603 capacitor]  (hidden comment: Generic Capacitor 15nF 0603)
C13  value 1nF  [Wurth 0603 capacitor]  (hidden comment: Generic Capacitor 1nF 0603)
C14  value 15nF  [Wurth 0603 capacitor]  (hidden comment: Generic Capacitor 15nF 0603)
C15  value 1nF  [Wurth 0603 capacitor]  (hidden comment: Generic Capacitor 1nF 0603)
C16  value 680µF/80V  [WURTH THT CAP D18H25 - sideways]  (hidden comment: NCC EKY-800ELL681MM25S)
C17  value 680µF/80V  [WURTH THT CAP D18H25 - sideways]  (hidden comment: NCC EKY-800ELL681MM25S)
C55  value 1uF  [Wurth 0603 capacitor]  (hidden comment: Generic Capacitor 1uF 0603)
J3  PHASE_A  [Solder Pad 3X4MM]
J4  PHASE_B  [Solder Pad 3X4MM]
J5  PHASE_C  [Solder Pad 3X4MM]
P4  61300211121  [2x1 2.54mm F]  (value not drawn)
Q1  IRF7749L1  [INFINEON DIRECTFET-L8-V]
Q2  IRF7749L1  [INFINEON DIRECTFET-L8-V]
Q3  IRF7749L1  [INFINEON DIRECTFET-L8-V]
Q4  IRF7749L1  [INFINEON DIRECTFET-L8-V]
Q5  IRF7749L1  [INFINEON DIRECTFET-L8-V]
Q6  IRF7749L1  [INFINEON DIRECTFET-L8-V]
R1  value 4R7  [Wurth 0603 Resistor]  (hidden comment: Generic Resistor 4k7 0603)
R2  value 4R7  [Wurth 0603 Resistor]  (hidden comment: Generic Resistor 4k7 0603)
R3  value 0.5m  [WURTH 2512 RESISTOR]  (hidden comment: Yezhan ASR-M-3-0.5F)
R4  value 0.5m  [WURTH 2512 RESISTOR]  (hidden comment: Yezhan ASR-M-3-0.5F)
R5  value 4R7  [Wurth 0603 Resistor]  (hidden comment: Generic Resistor 4k7 0603)
R6  value 4R7  [Wurth 0603 Resistor]  (hidden comment: Generic Resistor 4k7 0603)
R7  value 4R7  [Wurth 0603 Resistor]  (hidden comment: Generic Resistor 4k7 0603)
R8  value 1k  [Wurth 0603 Resistor]  (hidden comment: Generic Resistor 1k 0603)
R9  value 0.5m  [WURTH 2512 RESISTOR]  (hidden comment: Yezhan ASR-M-3-0.5F)
R10  value 4R7  [Wurth 0603 Resistor]  (hidden comment: Generic Resistor 4k7 0603)
R11  value 1k  [Wurth 0603 Resistor]  (hidden comment: Generic Resistor 1k 0603)
R12  value 1k  [Wurth 0603 Resistor]  (hidden comment: Generic Resistor 1k 0603)
R44  value 10k  [Wurth 0603 Resistor]  (hidden comment: Generic Resistor 10k 0603)
U2  SN74LVC1G66DBVR  [DBV0005A_L]
U3  SN74LVC1G66DBVR  [DBV0005A_L]
U4  SN74LVC1G66DBVR  [DBV0005A_L]

### Ports
FILT_EN (in), GH_A (in), GH_B (in), GH_C (in), GL_A (in), GL_B (in), GL_C (in), I_A_FILT (bidir), I_B_FILT (bidir), I_C_FILT (bidir), SH_A (bidir), SH_B (bidir), SH_C (bidir), SL_A (bidir), SL_B (bidir), SL_C (bidir), TEMP (bidir)

### Nets
3V3: B1.6(VS) B1.7(VREF1) B2.6(VS) B2.7(VREF1) B3.6(VS) B3.7(VREF1) C5.2 C8.2 C11.2 R44.2 U2.5(VCC) U3.5(VCC) U4.5(VCC)
GND: B1.2(GND) B1.3(VREF2) B2.2(GND) B2.3(VREF2) B3.2(GND) B3.3(VREF2) C1.2 C2.2 C3.2 C4.2 C5.1 C6.2 C7.2 C8.1 C9.1 C10.1 C11.1 C12.1 C13.1 C14.1 C15.1 C16.2(N) C17.2(N) C55.1 P4.2 Q3.4(SOURCE1) Q3.5(SOURCE2) Q3.6(SOURCE3) Q3.7(SOURCE4) Q3.8(SOURCE5) Q3.9(SOURCE6) Q3.10(SOURCE7) Q3.11(SOURCE8) Q4.4(SOURCE1) Q4.5(SOURCE2) Q4.6(SOURCE3) Q4.7(SOURCE4) Q4.8(SOURCE5) Q4.9(SOURCE6) Q4.10(SOURCE7) Q4.11(SOURCE8) Q6.4(SOURCE1) Q6.5(SOURCE2) Q6.6(SOURCE3) Q6.7(SOURCE4) Q6.8(SOURCE5) Q6.9(SOURCE6) Q6.10(SOURCE7) Q6.11(SOURCE8) U2.3(GND) U3.3(GND) U4.3(GND) ; port SL_A, port SL_B, port SL_C
VIN: C1.1 C2.1 C3.1 C4.1 C6.1 C7.1 C16.1(P) C17.1(P) Q1.1(DRAIN1) Q1.2(DRAIN2) Q1.3(DRAIN3) Q1.13(DRAIN4) Q1.14(DRAIN5) Q1.15(DRAIN6) Q2.1(DRAIN1) Q2.2(DRAIN2) Q2.3(DRAIN3) Q2.13(DRAIN4) Q2.14(DRAIN5) Q2.15(DRAIN6) Q5.1(DRAIN1) Q5.2(DRAIN2) Q5.3(DRAIN3) Q5.13(DRAIN4) Q5.14(DRAIN5) Q5.15(DRAIN6)
FILT_EN: U2.4(C) U3.4(C) U4.4(C) ; port FILT_EN
I_A: B1.5(OUT) R8.2
I_B: B2.5(OUT) R11.2
I_C: B3.5(OUT) R12.2
SH_A: B1.8(+IN) Q1.4(SOURCE1) Q1.5(SOURCE2) Q1.6(SOURCE3) Q1.7(SOURCE4) Q1.8(SOURCE5) Q1.9(SOURCE6) Q1.10(SOURCE7) Q1.11(SOURCE8) Q3.1(DRAIN1) Q3.2(DRAIN2) Q3.3(DRAIN3) Q3.13(DRAIN4) Q3.14(DRAIN5) Q3.15(DRAIN6) R3.2 ; port SH_A
SH_B: B2.8(+IN) Q2.4(SOURCE1) Q2.5(SOURCE2) Q2.6(SOURCE3) Q2.7(SOURCE4) Q2.8(SOURCE5) Q2.9(SOURCE6) Q2.10(SOURCE7) Q2.11(SOURCE8) Q4.1(DRAIN1) Q4.2(DRAIN2) Q4.3(DRAIN3) Q4.13(DRAIN4) Q4.14(DRAIN5) Q4.15(DRAIN6) R4.2 ; port SH_B
SH_C: B3.8(+IN) Q5.4(SOURCE1) Q5.5(SOURCE2) Q5.6(SOURCE3) Q5.7(SOURCE4) Q5.8(SOURCE5) Q5.9(SOURCE6) Q5.10(SOURCE7) Q5.11(SOURCE8) Q6.1(DRAIN1) Q6.2(DRAIN2) Q6.3(DRAIN3) Q6.13(DRAIN4) Q6.14(DRAIN5) Q6.15(DRAIN6) R9.2 ; port SH_C
NetB1_1: B1.1(-IN) J3.1 R3.1
NetB2_1: B2.1(-IN) J4.1 R4.1
NetB3_1: B3.1(-IN) J5.1 R9.1
NetC9_2: C9.2 U2.2(B)
NetC10_2: C10.2 R8.1 U2.1(A) ; port I_A_FILT
NetC12_2: C12.2 U3.2(B)
NetC13_2: C13.2 R11.1 U3.1(A) ; port I_B_FILT
NetC14_2: C14.2 U4.2(B)
NetC15_2: C15.2 R12.1 U4.1(A) ; port I_C_FILT
NetC55_2: C55.2 P4.1 R44.1 ; port TEMP
NetIC1_35: R10.1 ; port GL_C
NetIC1_37: R7.1 ; port GH_C
NetIC1_40: R6.1 ; port GL_B
NetIC1_42: R2.1 ; port GH_B
NetIC1_45: R5.1 ; port GL_A
NetIC1_47: R1.1 ; port GH_A
NetQ1_12: Q1.12(GATE) R1.2
NetQ2_12: Q2.12(GATE) R2.2
NetQ3_12: Q3.12(GATE) R5.2
NetQ4_12: Q4.12(GATE) R6.2
NetQ5_12: Q5.12(GATE) R7.2
NetQ6_12: Q6.12(GATE) R10.2

Not connected (* = marked no-connect by the designer): B1 4(NC)*; B2 4(NC)*; B3 4(NC)*

### Notes on the sheet
- (near C5) DNP
- (near C8) DNP
- (near C11) DNP
- (near P4) 10k NTC
- (in symbol IRF7749L1) 1,2,3,13,14,15; 4...11
- (in symbol NCC 680uF/80V TH) +

### Library data of the parts
B1-B3 = AD8418AWBRZ: Bidir.Zero-Drift Current Sense Amp SOIC8 Analog Devices AD8418AWBRZ, Current Sensing Amplifier Single Buffered 8-Pin SOIC; Geometry.Height: 1.1mm; Manufacturer_Name: Analog Devices; Manufacturer_Part_Number: AD8418AWBRZ; Mouser Part Number: 584-AD8418AWBRZ; Mouser Price/Stock: https://www.mouser.co.uk/ProductDetail/Analog-Devices/AD8418AWBRZ?qs=%2F9jDaHz9Z2grAr7OTzLKmg%3D%3D; Arrow Part Number: AD8418AWBRZ; Arrow Price/Stock: https://www.arrow.com/en/products/ad8418awbrz/analog-devices?utm_currency=USD&region=nac; Datasheet Link: http://www.analog.com/media/en/technical-documentation/data-sheets/AD8418A.pdf
C1-C4 C6 C7 = CMP-14477-000323-2: None; Tolerance: 10%; Voltage Rating: 100V; Max Operating Temperature: 125°C; Min Operating Temperature: -55°C; Packaging: Tape and Reel; Mount: Surface Mount; RoHS Compliant: Yes; Case Code (Metric): 3225; Case Code (Imperial): 1210; Case/Package: 1210
C16 C17 = NCC 680uF/80V TH: Bulk/Capacitor, Aluminum, 80 V, Cap.680 , Dia.18 , Leng.25 |Chemi-Con EKY-800ELL681MM25S; Manufacturer: United Chemi-Con; Dielectric Material: Aluminium; Dissipation Factor: 9%; Impedance: 36mΩ; Lead/Base Style: Straight; Leakage Current: 544µA; Life (Hours): 10000hours; Polarity: Polar; Ripple Current: 1.75A; Test Frequency: 100MHz; Tolerance: 20%; Voltage: 80V; Supplier: DigiKey; Supplier Part Number: 565-EKY-800ELL681MM25S-ND; Manufacturer Part Number: EKY-800ELL681MM25S; RoHS: Compliant; Category: Aluminum Electrolytic Capacitors; Stock: 70; Pricing: 1=2,66, 10=1,772, 50=1,4002, 100=1,283, 500=1,08148, 1000=1,01807, 2500=0,95043, 5000=0,90925 (USD); Case/Package: Radial; China RoHS: Compliant; Contact Plating: Tin; Diameter: 18mm; Height: 25mm; Height - Seated (Max): 26.4922mm; Lead Free: Lead Free; Lead Pitch: 7.493mm; Length: 25mm; Lifecycle Status: Production; Max Operating Temperature: 105°C; Min Operating Temperature: -40°C; Mounting Technology: Through Hole; Pins: 2; Number of Terminals: 2; Packaging: Bulk; Radiation Hardening: No; REACH SVHC: No; Schedule B: 853222***; Terminal Pitch: 7.5mm; Termination: Radial; Voltage Rating: 80V; Voltage Rating (DC): 80V; ComponentLink1URL: https://datasheet.octopart.com:443/EKY-800ELL681MM25S-Nippon-Chemicon-datasheet-182100250.pdf?src-supplier=IHS; ComponentLink1Description: https://datasheet.octopart.com:443/EKY-800ELL681MM25S-Nippon-Chemicon-datasheet-182100250.pdf?src-supplier=IHS; ComponentLink2URL: https://datasheet.octopart.com:443/EKY-800ELL681MM25S-United-Chemi-Con-datasheet-33024962.pdf?src-supplier=IHS; ComponentLink2Description: https://datasheet.octopart.com:443/EKY-800ELL681MM25S-United-Chemi-Con-datasheet-33024962.pdf?src-supplier=IHS; ComponentLink3URL: https://datasheet.octopart.com:443/EKY-800ELL681MM25S-United-Chemi-Con-datasheet-153683879.pdf?src-supplier=United+Chemi-Con; ComponentLink3Description: https://datasheet.octopart.com:443/EKY-800ELL681MM25S-United-Chemi-Con-datasheet-153683879.pdf?src-supplier=United+Chemi-Con; ComponentLink4URL: https://datasheet.octopart.com:443/EKY-800ELL681MM25S-United-Chemi-Con-datasheet-154730619.pdf?src-supplier=Electro+Sonic; ComponentLink4Description: https://datasheet.octopart.com:443/EKY-800ELL681MM25S-United-Chemi-Con-datasheet-154730619.pdf?src-supplier=Electro+Sonic
J3-J5 = Solder pad
P4 = 2P: WR-PHD Pin Header, THT, Vertical, pitch 2.54mm, 1 Row, 2P; Manufacturer: Wurth Elektronik; Contact Resistance: 20mOhm; Rated Current: 3A; Working Voltage: 250V; Withstanding Voltage: 500V; Manufacturer Part Number: 61300211121; Category: Board-to-Board Connectors; Match Code: WR-PHD; ComponentLink1Description: Website Link; ComponentLink1URL: https://www.we-online.com/redexpert/article/61300211121?ad; ComponentLink2Description: Datasheet Link; ComponentLink2URL: https://www.we-online.com/redexpert/spec/61300211121?ad; Mount: Through Hole; Operating Temperature Max: 105°C; Operating Temperature Min: -40°C; Packaging: Bag; Gender: Pin Header; Number of Pins: 2; Number of Rows: 1; Orientation: Vertical; Pitch: 2.54mm
Q1-Q6 = IRF7749L1: Insulated-Gate Field-Effect Transistor (IGFET), N-Channel, Enhancement, Body Diode, Pin 1 Drain, 2 Drain, 3 Drain , 4 Source, 5 Source, 6 Source, 7 Source, 8 Source, 9 Source, 10 Source, 11 Source, 12 Gate, 13 Drain, 14 Drain, 15 Drain, 15 Pins; Manufacturer: Infineon Technologies; PackageReference: DirectFET L8; Manufacturer Order Number: IRF7749L1
R1 R2 R5-R7 R10 = Generic Resistor 4R7 0603
R3 R4 R9 = Yezhan ASR-M-3-0.5F: 6W 0.5mΩ Patch Splitter ±115ppm/℃ ±1% 2512 Current Sense Resistors / Shunt Resistors ROHS
U2-U4 = CMP-0859-00173-3: as U6 on sheet DRV8301_Gate_Driver_Buck; Operating Temperature Range(C): -40 to 85; Generic Part Number: SN74LVC1G66; DatasheetVersion: SCES323O; PackageReference: DBV0005A; Channels(#): 1; 3-State Output: No

## Sheet STM32F405.SchDoc
size A4; SheetNumber: 2; SheetTotal: 4
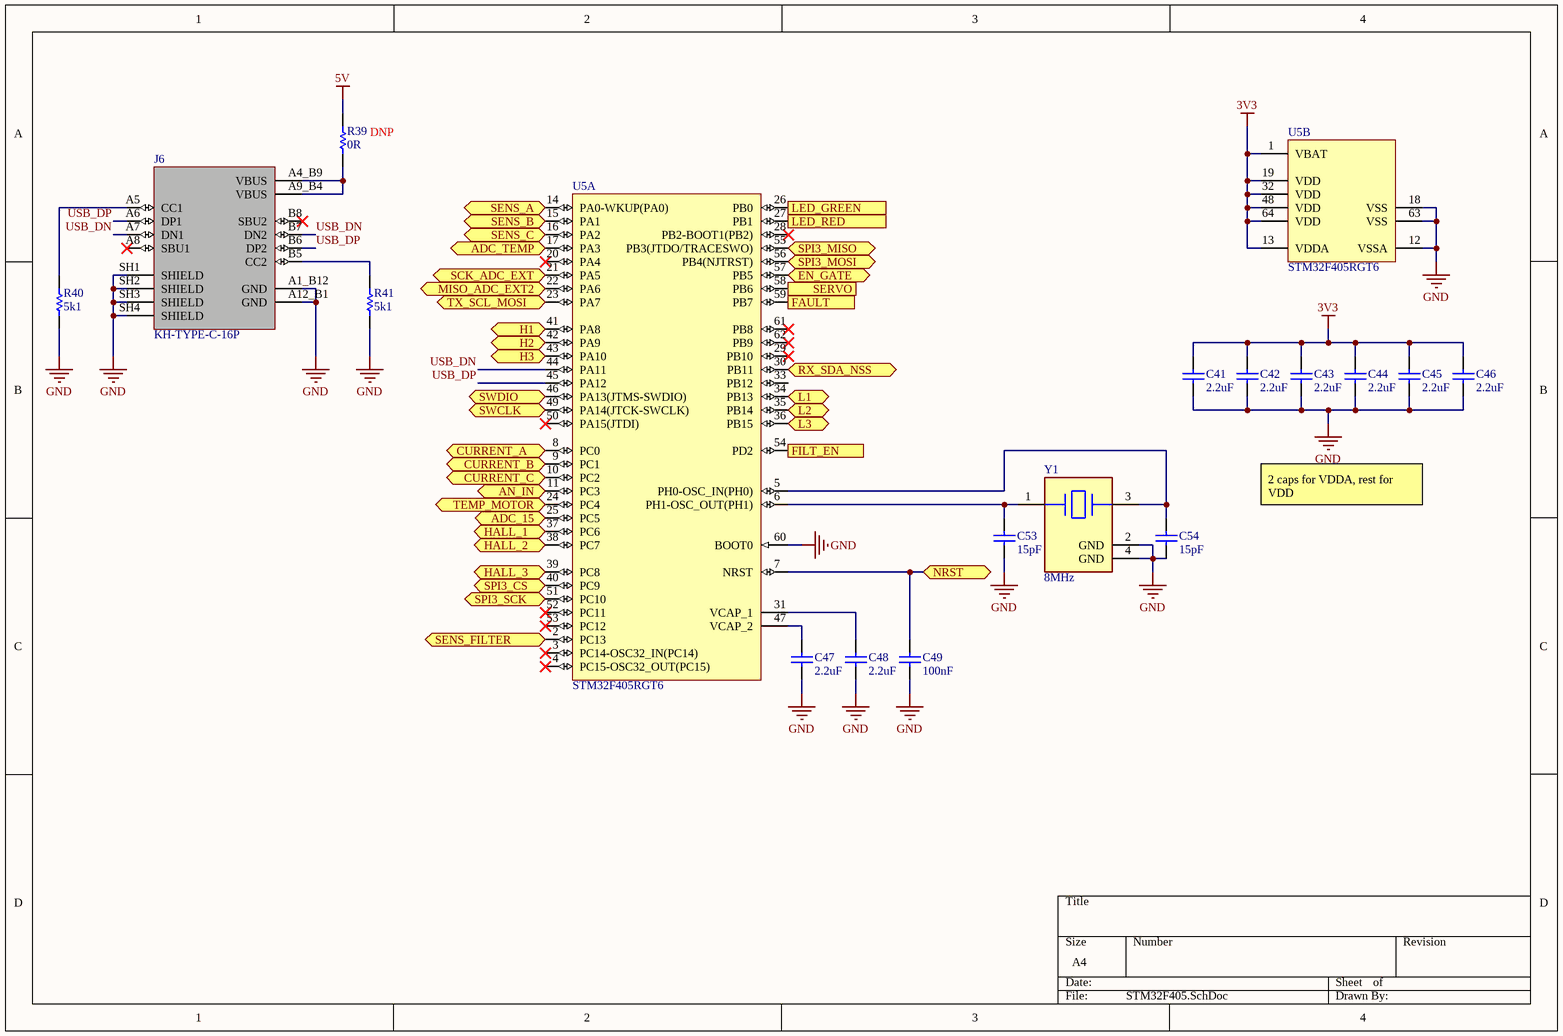
[diagram p3: STM32F405.SchDoc]

### Parts
C41  value 2.2uF  [Wurth 0603 capacitor]  (hidden comment: Generic Capacitor 2.2uF 0603)
C42  value 2.2uF  [Wurth 0603 capacitor]  (hidden comment: Generic Capacitor 2.2uF 0603)
C43  value 2.2uF  [Wurth 0603 capacitor]  (hidden comment: Generic Capacitor 2.2uF 0603)
C44  value 2.2uF  [Wurth 0603 capacitor]  (hidden comment: Generic Capacitor 2.2uF 0603)
C45  value 2.2uF  [Wurth 0603 capacitor]  (hidden comment: Generic Capacitor 2.2uF 0603)
C46  value 2.2uF  [Wurth 0603 capacitor]  (hidden comment: Generic Capacitor 2.2uF 0603)
C47  value 2.2uF  [Wurth 0603 capacitor]  (hidden comment: Generic Capacitor 2.2uF 0603)
C48  value 2.2uF  [Wurth 0603 capacitor]  (hidden comment: Generic Capacitor 2.2uF 0603)
C49  value 100nF  [Wurth 0603 capacitor]  (hidden comment: Generic Capacitor 100nF 0603)
C53  value 15pF  [Wurth 0603 capacitor]  (hidden comment: Generic Capacitor 15pF 0603)
C54  value 15pF  [Wurth 0603 capacitor]  (hidden comment: Generic Capacitor 15pF 0603)
J6  KH-TYPE-C-16P  [KINGHELM_KH-TYPE-C-16P]
R39  value 0R  [Wurth 0603 Resistor]  (hidden comment: Generic Resistor 0R 0603)
R40  value 5k1  [0805 Resistor]  (hidden comment: Generic Resistor 5k1 0805)
R41  value 5k1  [0805 Resistor]  (hidden comment: Generic Resistor 5k1 0805)
U5  STM32F405RGT6  [STM-LQFP64_M]  (parts A,B of 2)
Y1  value 8MHz  [huaxindianzi 8MHz Crystal]  (hidden comment: CF4008M00012001)

### Ports
ADC_15 (bidir), ADC_TEMP (bidir), AN_IN (bidir), CURRENT_A (bidir), CURRENT_B (bidir), CURRENT_C (bidir), EN_GATE (bidir), FAULT (in), FILT_EN (out), H1 (bidir), H2 (bidir), H3 (bidir), HALL_1 (bidir), HALL_2 (bidir), HALL_3 (bidir), L1 (bidir), L2 (bidir), L3 (bidir), LED_GREEN (out), LED_RED (out), MISO_ADC_EXT2 (bidir), NRST (bidir), RX_SDA_NSS (bidir), SCK_ADC_EXT (bidir), SENS_A (bidir), SENS_B (bidir), SENS_C (bidir), SENS_FILTER (bidir), SERVO (in), SPI3_CS (bidir), SPI3_MISO (bidir), SPI3_MOSI (bidir), SPI3_SCK (bidir), SWCLK (bidir), SWDIO (bidir), TEMP_MOTOR (bidir), TX_SCL_MOSI (bidir)

### Nets
3V3: C41.2 C42.2 C43.2 C44.2 C45.2 C46.2 U5.1(VBAT) U5.13(VDDA) U5.19(VDD) U5.32(VDD) U5.48(VDD) U5.64(VDD)
5V: R39.2
GND: C41.1 C42.1 C43.1 C44.1 C45.1 C46.1 C47.1 C48.1 C49.1 C53.1 C54.1 J6.A1_B12(GND) J6.A12_B1(GND) J6.SH1(SHIELD) J6.SH2(SHIELD) J6.SH3(SHIELD) J6.SH4(SHIELD) R40.1 R41.1 U5.12(VSSA) U5.18(VSS) U5.60(BOOT0) U5.63(VSS) Y1.2(GND) Y1.4(GND)
FILT_EN: U5.54(PD2) ; port FILT_EN
SENS_FILTER: U5.2(PC13) ; port SENS_FILTER
SHUTDOWN: U5.25(PC5) ; port ADC_15
USB_DN: J6.A7(DN1) J6.B7(DN2) U5.44(PA11)
USB_DP: J6.A6(DP1) J6.B6(DP2) U5.45(PA12)
NetC10_2: U5.9(PC1) ; port CURRENT_B
NetC13_2: U5.8(PC0) ; port CURRENT_A
NetC15_2: U5.10(PC2) ; port CURRENT_C
NetC33_1: U5.14(PA0-WKUP(PA0)) ; port SENS_A
NetC37_1: U5.15(PA1) ; port SENS_B
NetC40_1: U5.16(PA2) ; port SENS_C
NetC47_2: C47.2 U5.47(VCAP_2)
NetC48_2: C48.2 U5.31(VCAP_1)
NetC49_2: C49.2 U5.7(NRST) ; port NRST
NetC50_2: U5.24(PC4) ; port TEMP_MOTOR
NetC53_2: C53.2 U5.6(PH1-OSC_OUT(PH1)) Y1.1
NetC54_2: C54.2 U5.5(PH0-OSC_IN(PH0)) Y1.3
NetC55_2: U5.17(PA3) ; port ADC_TEMP
NetC56_2: U5.58(PB6) ; port SERVO
NetD2_2: U5.26(PB0) ; port LED_GREEN
NetD3_2: U5.27(PB1) ; port LED_RED
NetIC1_6: U5.59(PB7) ; port FAULT
NetIC1_8: U5.40(PC9) ; port SPI3_CS
NetIC1_9: U5.56(PB4(NJTRST)) ; port SPI3_MOSI
NetIC1_10: U5.55(PB3(JTDO/TRACESWO)) ; port SPI3_MISO
NetIC1_11: U5.51(PC10) ; port SPI3_SCK
NetIC1_16: U5.57(PB5) ; port EN_GATE
NetIC1_17: U5.41(PA8) ; port H1
NetIC1_18: U5.34(PB13) ; port L1
NetIC1_19: U5.42(PA9) ; port H2
NetIC1_20: U5.35(PB14) ; port L2
NetIC1_21: U5.43(PA10) ; port H3
NetIC1_22: U5.36(PB15) ; port L3
NetJ6_A4_B9: J6.A4_B9(VBUS) J6.A9_B4(VBUS) R39.1
NetJ6_A5: J6.A5(CC1) R40.2
NetJ6_B5: J6.B5(CC2) R41.2
NetP1_3: U5.37(PC6) ; port HALL_1
NetP1_4: U5.38(PC7) ; port HALL_2
NetP1_5: U5.39(PC8) ; port HALL_3
NetP2_4: U5.21(PA5) ; port SCK_ADC_EXT
NetP2_5: U5.30(PB11) ; port RX_SDA_NSS
NetP2_6: U5.23(PA7) ; port TX_SCL_MOSI
NetP2_7: U5.22(PA6) ; port MISO_ADC_EXT2
NetP3_2: U5.46(PA13(JTMS-SWDIO)) ; port SWDIO
NetP3_4: U5.49(PA14(JTCK-SWCLK)) ; port SWCLK
NetQ7_2: U5.11(PC3) ; port AN_IN

Not connected (* = marked no-connect by the designer): J6 A8(SBU1)* B8(SBU2)*; U5 3(PC14-OSC32_IN(PC14))* 4(PC15-OSC32_OUT(PC15))* 20(PA4)* 28(PB2-BOOT1(PB2))* 29(PB10)* 33(PB12) 50(PA15(JTDI))* 52(PC11)* 53(PC12)* 61(PB8)* 62(PB9)*

### Notes on the sheet
- (near R39) DNP
- 2 caps for VDDA, rest for VDD

### Library data of the parts
J6 = KH-TYPE-C-16P: MF: kinghelm; Value: *; SnapEDA_Link: https://www.snapeda.com/parts/KH-TYPE-C-16P/Ki/view-part/?ref=snap; MP: KH-TYPE-C-16P; Check_prices: https://www.snapeda.com/parts/KH-TYPE-C-16P/Ki/view-part/?ref=eda; Availability: Not in stock; Price: None; Package: None
U5 = CMP-0243-00019-3: ARM Cortex-M4 32-bit MCU+FPU, 210 DMIPS, 1024 kB Flash, 192 kB Internal RAM, 51 I/Os, 64-pin LQFP, -40 to 85 degC, Tray; Manufacturer: STMicroelectronics; Supply Voltage(Vcc) min (V): 1.8; Supply Voltage(Vcc) max (V): 3.6; Internal RAM Size (kB): 192; I/Os (High Current): 51; D/A Converter: 2x12-bit; FLASH Size (Prog) (kB): 1024; Operating Frequency(F) (Processor speed) (MHz): 168; ComponentLink2Description: Datasheet; PackageVersion: Rev. 4, 06/2013; DatasheetVersion: Rev. 4; Core: ARM Cortex-M4; ComponentLink2URL: http://www.st.com/st-web-ui/static/active/en/resource/technical/document/datasheet/DM00037051.pdf; PackageReference: LQFP64; Packing: Tray; ComponentLink1Description: Manufacturer URL; ComponentLink3URL: http://www.st.com/st-web-ui/static/active/en/resource/technical/document/datasheet/DM00037051.pdf; ComponentLink3Description: Package Specification; Mounting Technology: Surface Mount; ComponentLink1URL: http://www.st.com/web/en/home.html; PackageDescription: 64-Pin Low Profile Quad Flat Package, 10 x 10 mm Body, 0.5 mm Pitch; PartNumber: STM32F405RGT6
Y1 = 8MHz huaxindianzi Crystal

## Nets that join several sheets
3V3: Top_Design (5 pins), DRV8301_Gate_Driver_Buck (7 pins), Power (13 pins), STM32F405 (12 pins)
5V: Top_Design (P2.1 P5.2 R31.2), DRV8301_Gate_Driver_Buck (8 pins), STM32F405 (R39.2)
GND: Top_Design (13 pins), DRV8301_Gate_Driver_Buck (40 pins), Power (52 pins), STM32F405 (25 pins)
VIN: DRV8301_Gate_Driver_Buck (8 pins), Power (26 pins)
EN_BUCK: Top_Design (C52.2 D8.1 R34.1 R35.1), DRV8301_Gate_Driver_Buck (IC1.55)
FILT_EN: Power (U2.4 U3.4 U4.4), STM32F405 (U5.54)
NetC10_2: Power (C10.2 R8.1 U2.1), STM32F405 (U5.9)
NetC13_2: Power (C13.2 R11.1 U3.1), STM32F405 (U5.8)
NetC15_2: Power (C15.2 R12.1 U4.1), STM32F405 (U5.10)
NetC33_1: DRV8301_Gate_Driver_Buck (C33.1 R19.1 R20.2), STM32F405 (U5.14)
NetC37_1: DRV8301_Gate_Driver_Buck (C37.1 R21.1 R22.2), STM32F405 (U5.15)
NetC40_1: DRV8301_Gate_Driver_Buck (C40.1 R23.1 R24.2), STM32F405 (U5.16)
NetC49_2: Top_Design (P3.1), STM32F405 (C49.2 U5.7)
NetC50_2: Top_Design (C50.2 P1.2 R33.1), STM32F405 (U5.24)
NetC55_2: Power (C55.2 P4.1 R44.1), STM32F405 (U5.17)
NetC56_2: Top_Design (C56.2 R45.2), STM32F405 (U5.58)
NetD2_2: Top_Design (D2.2), STM32F405 (U5.26)
NetD3_2: Top_Design (D3.2), STM32F405 (U5.27)
NetIC1_6: DRV8301_Gate_Driver_Buck (IC1.6), STM32F405 (U5.59)
NetIC1_8: DRV8301_Gate_Driver_Buck (IC1.8), STM32F405 (U5.40)
NetIC1_9: DRV8301_Gate_Driver_Buck (IC1.9), STM32F405 (U5.56)
NetIC1_10: DRV8301_Gate_Driver_Buck (IC1.10), STM32F405 (U5.55)
NetIC1_11: DRV8301_Gate_Driver_Buck (IC1.11), STM32F405 (U5.51)
NetIC1_16: DRV8301_Gate_Driver_Buck (IC1.16 R16.2), STM32F405 (U5.57)
NetIC1_17: DRV8301_Gate_Driver_Buck (IC1.17), STM32F405 (U5.41)
NetIC1_18: DRV8301_Gate_Driver_Buck (IC1.18), STM32F405 (U5.34)
NetIC1_19: DRV8301_Gate_Driver_Buck (IC1.19), STM32F405 (U5.42)
NetIC1_20: DRV8301_Gate_Driver_Buck (IC1.20), STM32F405 (U5.35)
NetIC1_21: DRV8301_Gate_Driver_Buck (IC1.21), STM32F405 (U5.43)
NetIC1_22: DRV8301_Gate_Driver_Buck (IC1.22), STM32F405 (U5.36)
NetIC1_35: DRV8301_Gate_Driver_Buck (IC1.35), Power (R10.1)
NetIC1_37: DRV8301_Gate_Driver_Buck (IC1.37), Power (R7.1)
NetIC1_40: DRV8301_Gate_Driver_Buck (IC1.40), Power (R6.1)
NetIC1_42: DRV8301_Gate_Driver_Buck (IC1.42), Power (R2.1)
NetIC1_45: DRV8301_Gate_Driver_Buck (IC1.45), Power (R5.1)
NetIC1_47: DRV8301_Gate_Driver_Buck (IC1.47), Power (R1.1)
NetP1_3: Top_Design (P1.3 R29.2), STM32F405 (U5.37)
NetP1_4: Top_Design (P1.4 R30.2), STM32F405 (U5.38)
NetP1_5: Top_Design (P1.5 R32.2), STM32F405 (U5.39)
NetP2_4: Top_Design (P2.4), STM32F405 (U5.21)
NetP2_5: Top_Design (P2.5), STM32F405 (U5.30)
NetP2_6: Top_Design (P2.6), STM32F405 (U5.23)
NetP2_7: Top_Design (P2.7), STM32F405 (U5.22)
NetP3_2: Top_Design (P3.2), STM32F405 (U5.46)
NetP3_4: Top_Design (P3.4), STM32F405 (U5.49)
NetQ7_2: DRV8301_Gate_Driver_Buck (Q7.2 R43.2), STM32F405 (U5.11)
SENS_FILTER: DRV8301_Gate_Driver_Buck (U6.4 U7.4 U9.4), STM32F405 (U5.2)
SH_A: Top_Design (D5.2), DRV8301_Gate_Driver_Buck (C30.1 IC1.46 R19.2), Power (16 pins)
SH_B: DRV8301_Gate_Driver_Buck (C31.1 IC1.41 R21.2), Power (16 pins)
SH_C: DRV8301_Gate_Driver_Buck (C34.1 IC1.36 R23.2), Power (16 pins)
SHUTDOWN: Top_Design (R36.2), STM32F405 (U5.25)